# EAGLE design wemos_rfmaster7x (EAGLE 7.7.0)
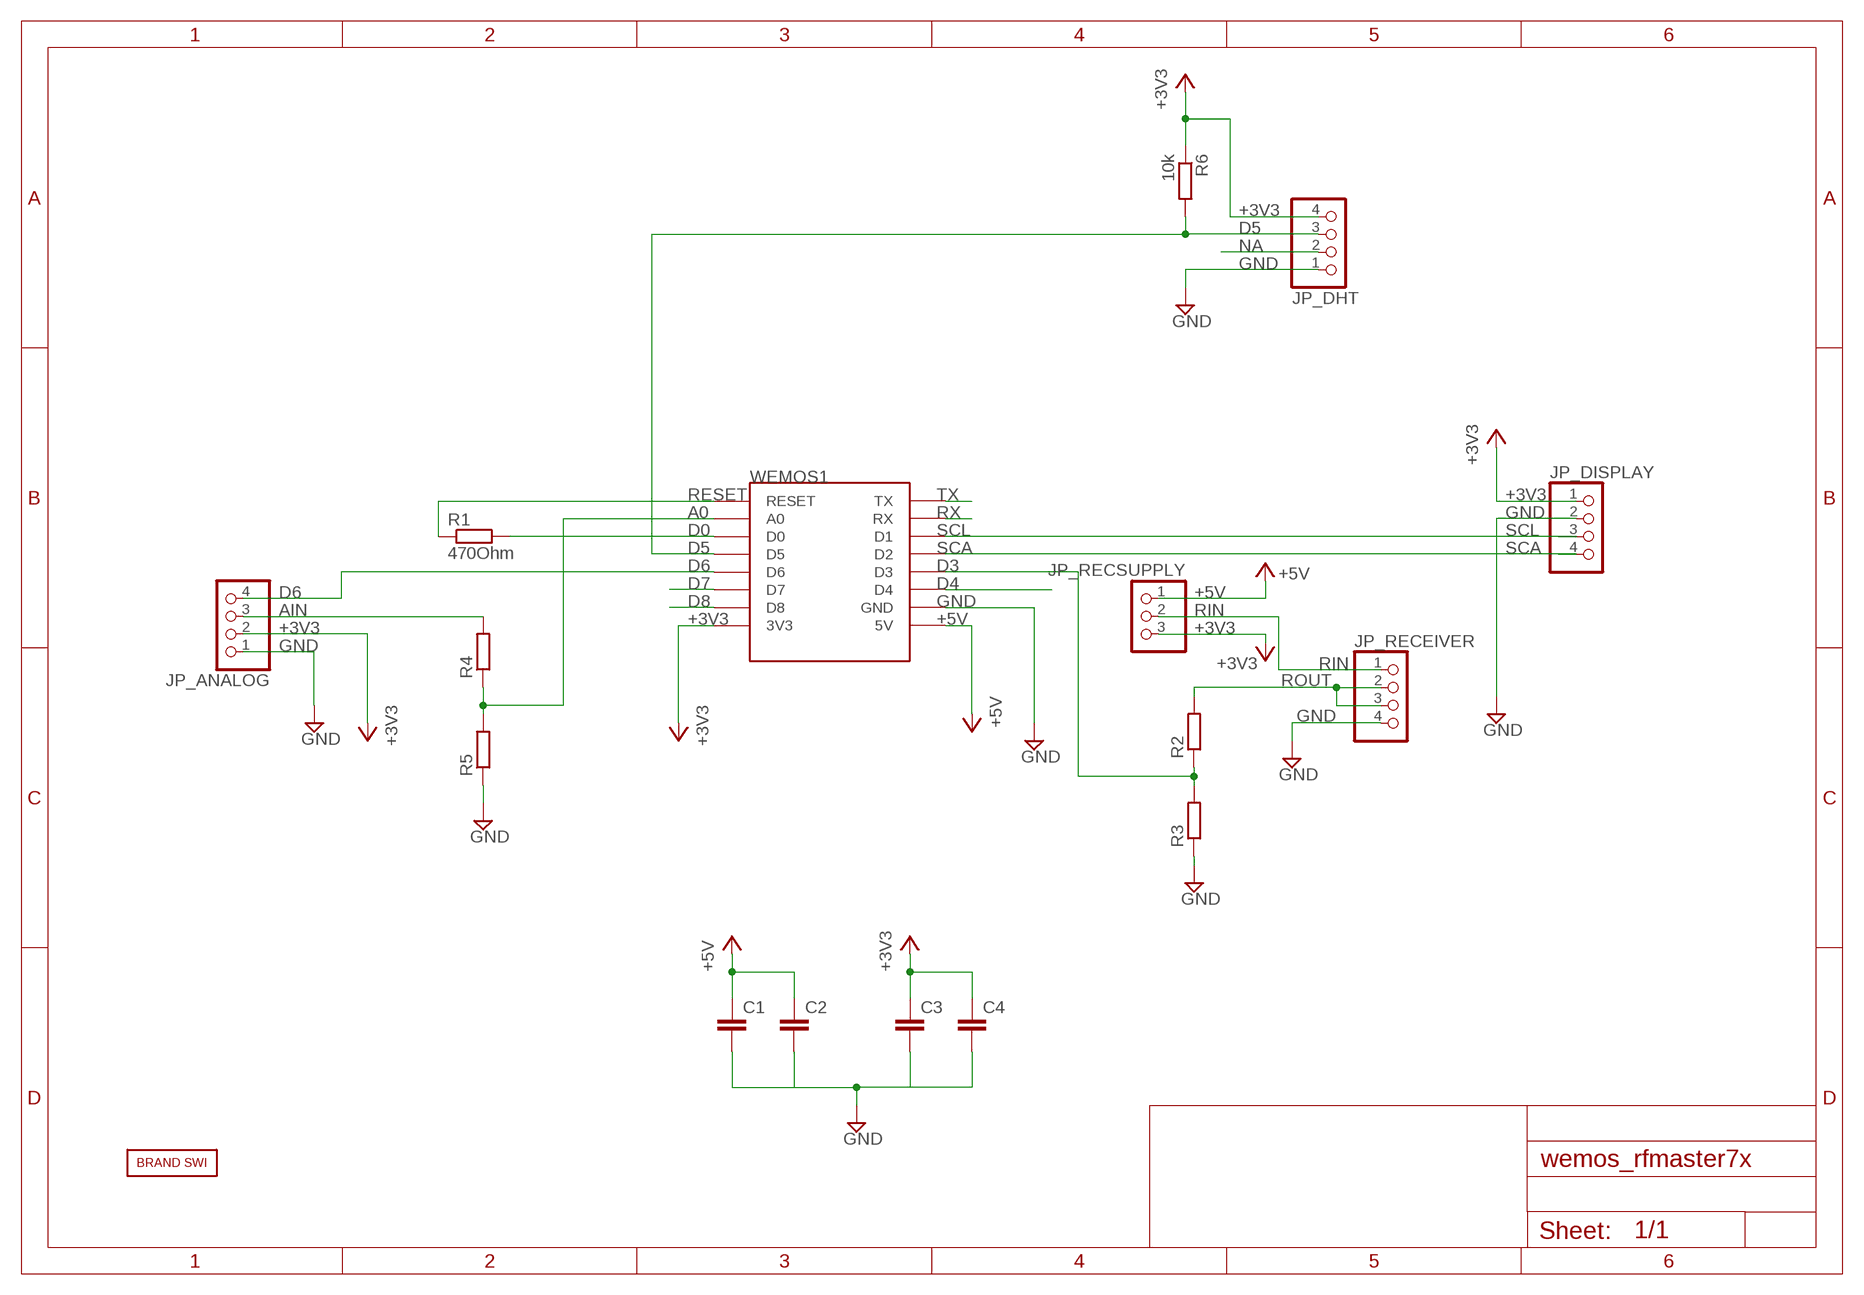
[diagram p0: schematic, sheet 1]

## Parts
C1  C-EUC1210  [C1210]
C2  C-EUC1210  [C1210]
C3  C-EUC1210  [C1210]
C4  C-EUC1210  [C1210]
JP_ANALOG  PINHD-1X4  [1X04]
JP_DHT  PINHD-1X4  [1X04]
JP_DISPLAY  PINHD-1X4  [1X04]
JP_RECEIVER  PINHD-1X4  [1X04]
JP_RECSUPPLY  PINHD-1X3  [1X03]
R1  470Ohm  R-EU_R0805  [R0805]
R2  R-EU_R0805  [R0805]
R3  R-EU_R0805  [R0805]
R4  R-EU_R0805  [R0805]
R5  R-EU_R0805  [R0805]
R6  10k  R-EU_R0805  [R0805]
U$2  BRAND_SWI5X7  [BRAND_SWI_5X7]
WEMOS1  WEMOS-D1-MINI  [WEMOS-D1-MINI]

## Nets
+3V3: C3.1 C4.1 JP_ANALOG.2 JP_DHT.4 JP_DISPLAY.1 JP_RECSUPPLY.3 R6.1 WEMOS1.3V3
+5V: C1.1 C2.1 JP_RECSUPPLY.1 WEMOS1.5V
A0: R4.1 R5.2 WEMOS1.A0
AIN: JP_ANALOG.3 R4.2
D0: R1.2 WEMOS1.D0
D3: R2.1 R3.2 WEMOS1.D3
D4: WEMOS1.D4
D5: JP_DHT.3 R6.2 WEMOS1.D5
D6: JP_ANALOG.4 WEMOS1.D6
D7: WEMOS1.D7
D8: WEMOS1.D8
GND: C1.2 C2.2 C3.2 C4.2 JP_ANALOG.1 JP_DHT.1 JP_DISPLAY.2 JP_RECEIVER.4 R3.1 R5.1 WEMOS1.GND
NA: JP_DHT.2
RESET: R1.1 WEMOS1.RESET
RIN: JP_RECEIVER.1 JP_RECSUPPLY.2
ROUT: JP_RECEIVER.2 JP_RECEIVER.3 R2.2
RX: WEMOS1.RX
SCA: JP_DISPLAY.4 WEMOS1.D2
SCL: JP_DISPLAY.3 WEMOS1.D1
TX: WEMOS1.TX

## Library data of the parts
C1-C4 = rcl:C-EU: CAPACITOR, European symbol
JP_ANALOG JP_DISPLAY JP_RECEIVER = pinhead:PINHD-1X4: PIN HEADER
JP_DHT = pinhead@1:PINHD-1X4: PIN HEADER
JP_RECSUPPLY = pinhead@1:PINHD-1X3: PIN HEADER
R1-R6 = rcl:R-EU_: RESISTOR, European symbol
U$2 = BRAND_SWI:BRAND_SWI
WEMOS1 = SWI_COMMONS:WEMOS-D1-MINI: WeMos.cc D1 mini ESP8266 module

## Net classes
0 default: clearance 0.205 mm

## Board
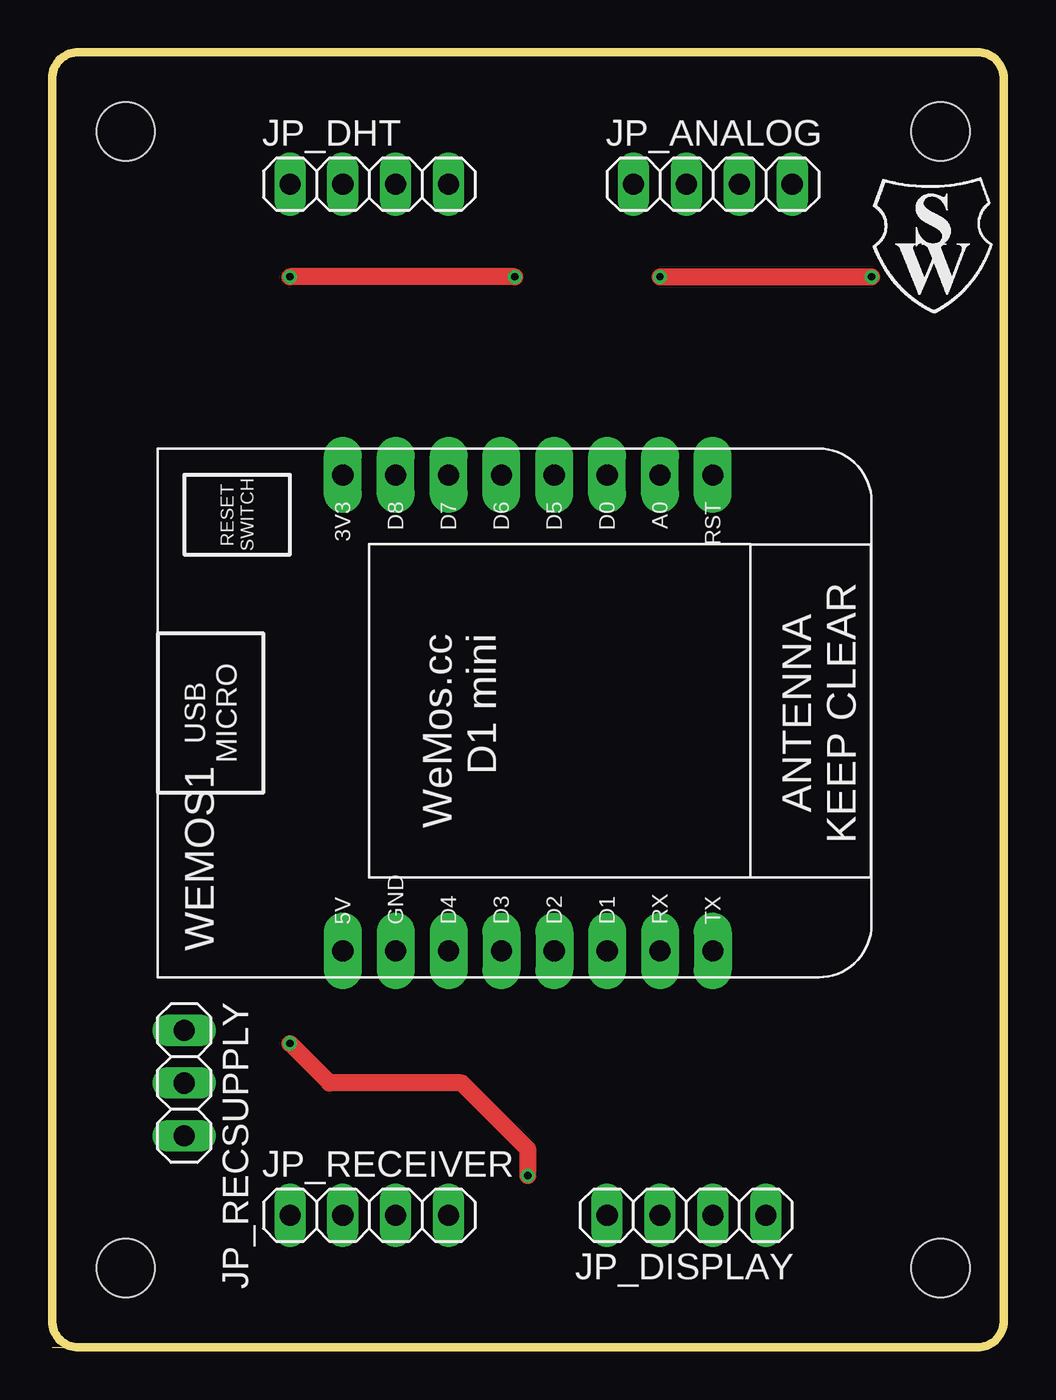
[diagram p1: board, top side]
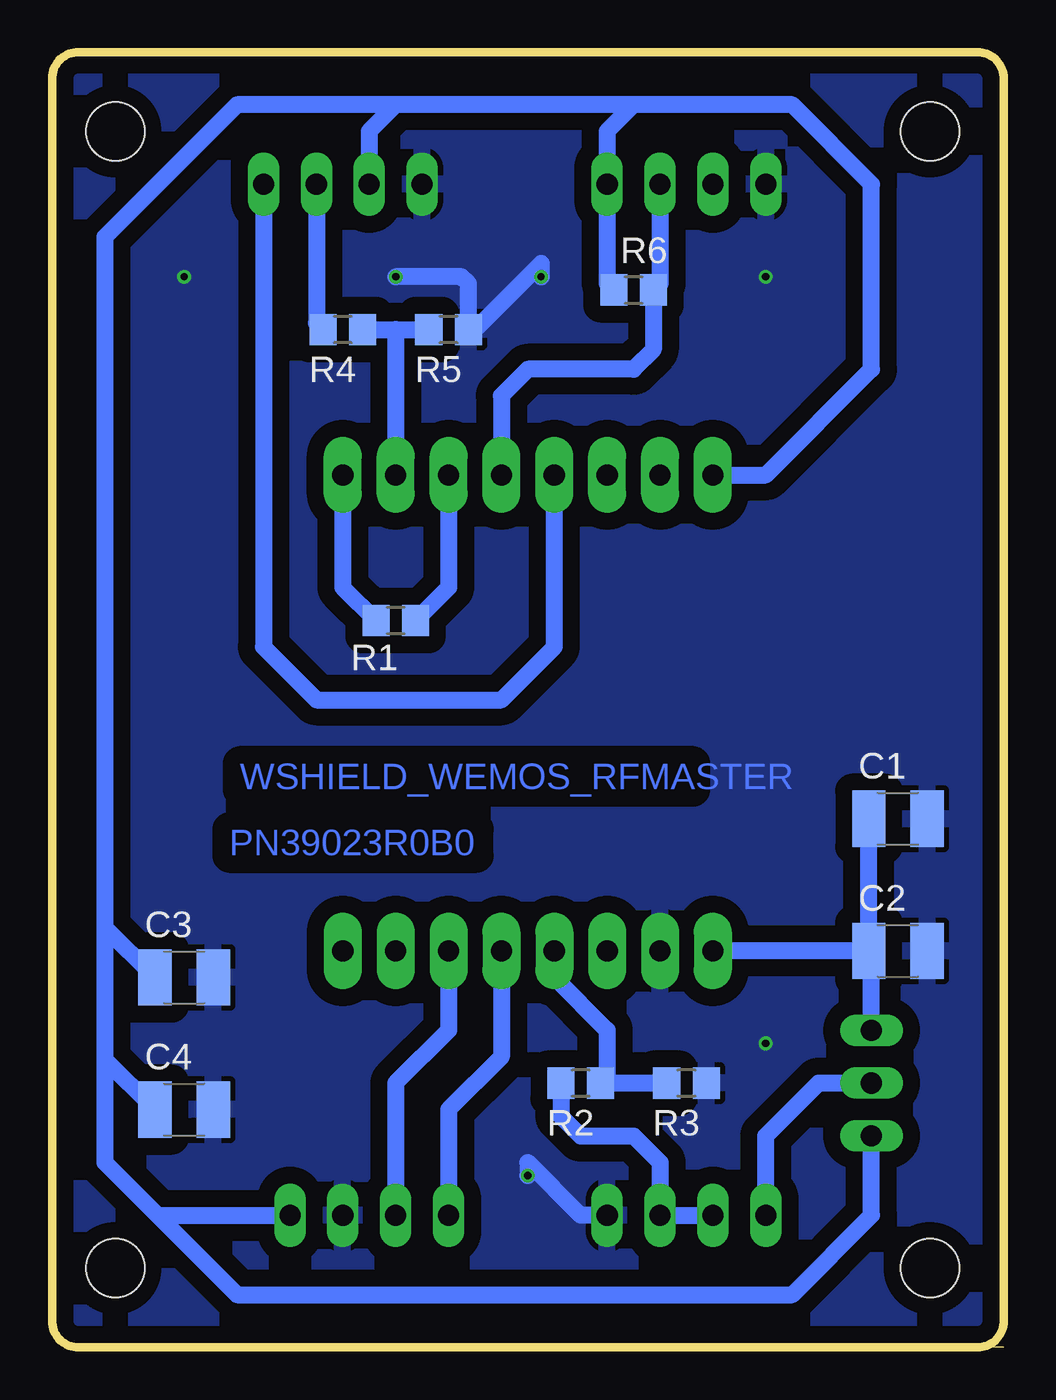
[diagram p2: board, bottom side, seen from below]

Size 45.72 x 62.23 mm. Coordinates in mm from the lower left corner, seen from the top.
Outline: 0,0 1.27,0
Outline: 1.27,0 2.03,0
Outline: 28.45,0 31.42,0
Outline: 1.27,0 44.45,0 arc90 45.72,1.27 45.72,60.96 arc90 44.45,62.23 1.27,62.23 arc90 0,60.96 0,1.27 arc90 1.27,0
Copper layers (1*16): Top 0.035mm / dielectric 1.6mm / Bottom 0.035mm
Design rules "Elecrow_2-layer_PCB_eagle_rule *": minimum track width 12mil, minimum drill 12mil, track to track 6mil, track to pad 6mil, pad to pad 6mil, via to via 8mil, smd to smd 0mil, copper to edge 20mil, drill to drill 10mil, minimum pad ring 6mil, minimum via ring 6mil, stop-mask expansion 0mil, vias tented up to drill 100mil, thermal gap 10mil
Holes 2.8 mm at 3.54,58.42 42.68,58.42 42.68,3.81 3.54,3.81

### Footprints (pad centres in the part's own frame; a part is rotated, then mirrored left to right if it is on the bottom)
C1210 = smd 1.6 x 2.7: 1 -1.4,0; 2 1.4,0
1X04 = drill 1.016 long: 1 -3.81,0; 2 -1.27,0; 3 1.27,0; 4 3.81,0
1X03 = drill 1.016 long: 1 -2.54,0; 2 0,0; 3 2.54,0
R0805 = smd 1.3 x 1.5: 1 -0.95,0; 2 0.95,0
WEMOS-D1-MINI = drill 1.016 pad 1.829 long: 3V3 -10.16,-10.16; 5V 12.7,-10.16; A0 -10.16,5.08; D0 -10.16,2.54; D1 12.7,2.54; D2 12.7,0; D3 12.7,-2.54; D4 12.7,-5.08; D5 -10.16,0; D6 -10.16,-2.54; D7 -10.16,-5.08; D8 -10.16,-7.62; GND 12.7,-7.62; RESET -10.16,7.62; RX 12.7,5.08; TX 12.7,7.62

### Placement (x,y rotation side)
C1  5.08,25.4 0 bottom
C2  5.08,19.05 0 bottom
C3  39.37,17.78 0 bottom
C4  39.37,11.43 0 bottom
JP_ANALOG  31.75,55.88 0 top
JP_DHT  15.24,55.88 0 top
JP_DISPLAY  30.48,6.35 180 top
JP_RECEIVER  15.24,6.35 0 top
JP_RECSUPPLY  6.35,12.7 270 top
R1  29.21,34.92 0 bottom
R2  20.32,12.7 180 bottom
R3  15.24,12.7 180 bottom
R4  31.75,48.9 180 bottom
R5  26.67,48.9 180 bottom
R6  17.78,50.8 0 bottom
U$2  39.24,49.53 0 top
WEMOS1  24.13,31.75 270 top

### Tracks (layer width: path | path; a pad name or v marks a point on that pad's centre or on a via)
+3V3
  Bottom 0.813: WEMOS1.3V3 11.43,41.91 6.35,46.99 6.35,55.88 10.16,59.69 17.78,59.69 | 17.78,59.69 19.05,58.42 JP_DHT.4 19.05,51.12 R6.1 | 17.78,59.69 29.21,59.69 | 29.21,59.69 30.48,58.42 JP_ANALOG.2 | 29.21,59.69 36.83,59.69 43.18,53.34 43.18,20.19 | C3.1 43.18,20.19 | C4.1 43.18,13.84 | 43.18,20.19 43.18,13.84 | 43.18,13.84 43.18,8.89 40.64,6.35 | 40.64,6.35 JP_DISPLAY.1 | 40.64,6.35 36.83,2.54 10.16,2.54 6.35,6.35 JP_RECSUPPLY.3
+5V
  Bottom 0.813: C2.1 WEMOS1.5V | C2.1 C1.1 | C2.1 6.35,18.92 JP_RECSUPPLY.1
A0
  Bottom 0.813: R4.1 29.21,48.9 | 29.21,48.9 R5.2 | 29.21,48.9 WEMOS1.A0
AIN
  Bottom 0.813: JP_ANALOG.3 33.02,49.22 R4.2
D0
  Bottom 0.813: WEMOS1.D0 26.67,36.52 R1.2
D3
  Bottom 0.813: WEMOS1.D3 21.59,17.78 19.05,15.24 19.05,13.02 R2.1 R3.2
D5
  Bottom 0.813: JP_DHT.3 16.51,51.12 R6.2 16.83,47.94 17.78,46.99 22.86,46.99 24.13,45.72 WEMOS1.D5
D6
  Bottom 0.813: JP_ANALOG.4 35.56,33.66 33.02,31.11 24.13,31.11 21.59,33.66 WEMOS1.D6
GND  (via drill 0.35)
  Top 0.813: v22.86,8.26 22.86,9.53 19.68,12.7 13.34,12.7 v11.43,14.61 | v22.23,51.44 v11.43,51.44 | v29.21,51.44 v39.37,51.44
  Bottom 0.813: JP_RECEIVER.4 20.32,6.35 22.86,8.89 v22.86,8.26 | v22.23,51.44 22.23,52.07 25.4,48.9 R5.1 25.72,51.12 26.04,51.44 v29.21,51.44
  pour Bottom (isolate 0.813): 0,0 0,62.23 45.72,62.23 45.72,0
RESET
  Bottom 0.813: WEMOS1.RESET 31.75,36.52 R1.1
RIN
  Bottom 0.813: JP_RECEIVER.1 11.43,10.16 8.89,12.7 JP_RECSUPPLY.2
ROUT
  Bottom 0.813: R2.2 21.27,11.11 20.32,10.16 17.78,10.16 16.51,8.89 JP_RECEIVER.3 JP_RECEIVER.2
SCA
  Bottom 0.813: WEMOS1.D2 24.13,13.97 26.67,11.43 JP_DISPLAY.4
SCL
  Bottom 0.813: WEMOS1.D1 26.67,15.24 29.21,12.7 JP_DISPLAY.3

### Text on the board
Bottom: WSHIELD_WEMOS_RFMASTER | PN39023R0B0